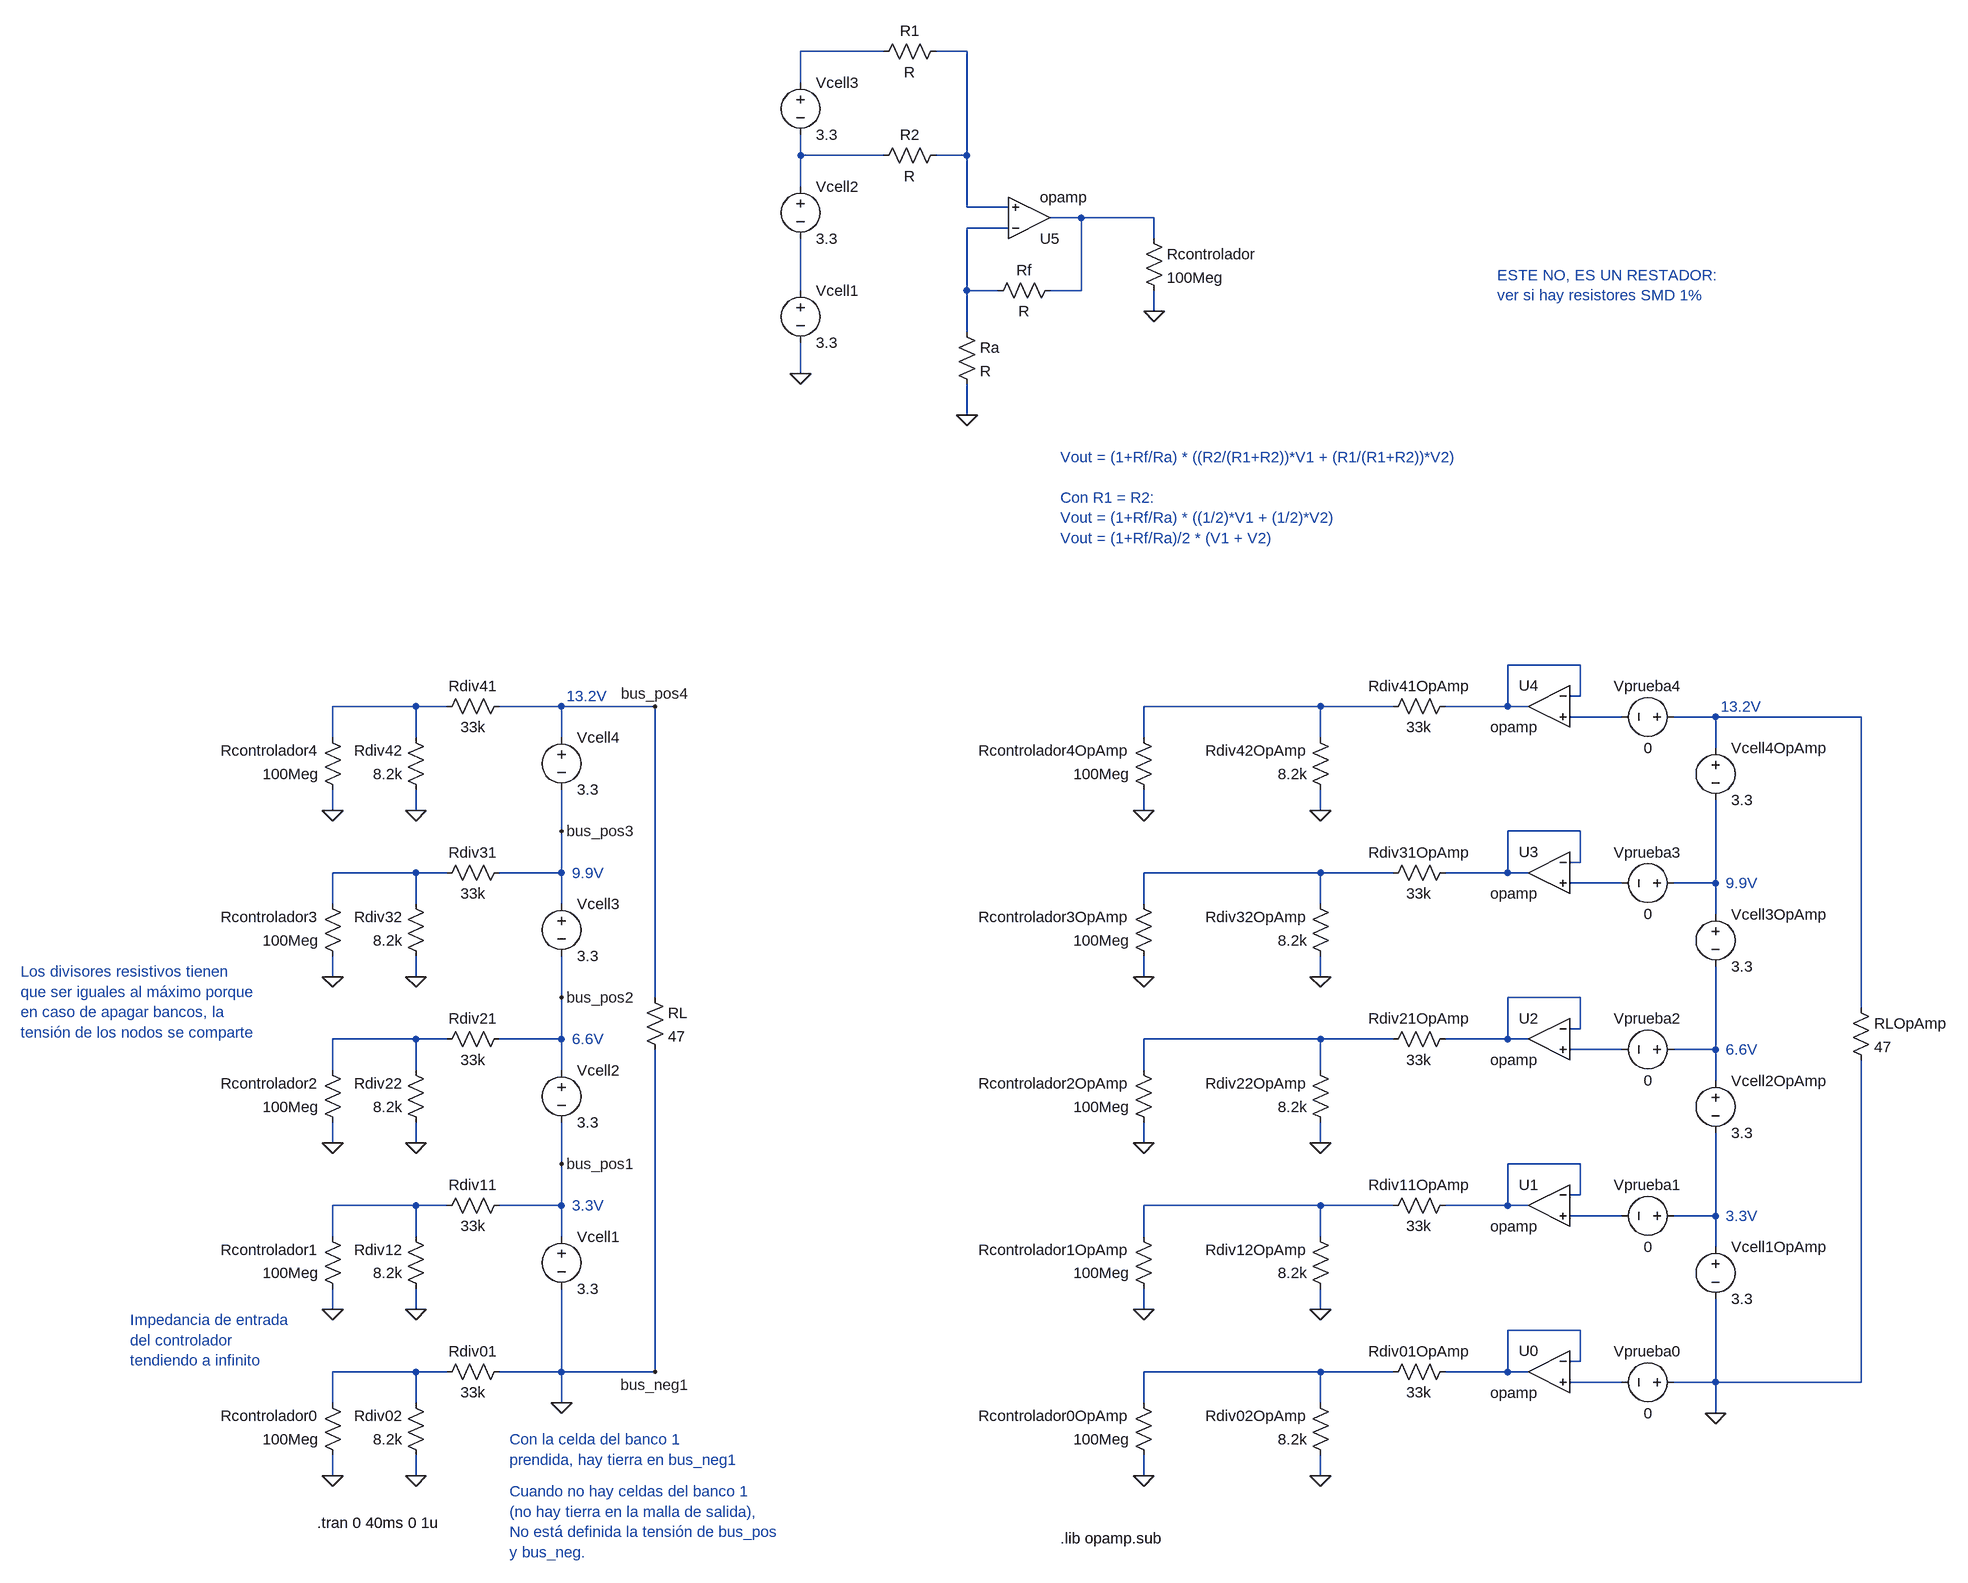
[diagram p0: schematic Opamps en modo sumador no inversor.asc]
Opamps en modo sumador no inversor.asc, the LTspice schematic file:
Version 4.1
SHEET 1 2156 1480
WIRE 512 -1712 384 -1712
WIRE 640 -1712 592 -1712
WIRE 384 -1664 384 -1712
WIRE 384 -1552 384 -1584
WIRE 512 -1552 384 -1552
WIRE 640 -1552 640 -1712
WIRE 640 -1552 592 -1552
WIRE 384 -1504 384 -1552
WIRE 640 -1472 640 -1552
WIRE 704 -1472 640 -1472
WIRE 816 -1456 768 -1456
WIRE 928 -1456 816 -1456
WIRE 704 -1440 640 -1440
WIRE 928 -1424 928 -1456
WIRE 384 -1344 384 -1424
WIRE 640 -1344 640 -1440
WIRE 688 -1344 640 -1344
WIRE 816 -1344 816 -1456
WIRE 816 -1344 768 -1344
WIRE 928 -1312 928 -1344
WIRE 640 -1280 640 -1344
WIRE 384 -1216 384 -1264
WIRE 640 -1152 640 -1200
WIRE 1584 -768 1472 -768
WIRE 1584 -720 1584 -768
WIRE 1584 -720 1568 -720
WIRE -208 -704 -336 -704
WIRE -160 -704 -208 -704
WIRE 16 -704 -80 -704
WIRE 160 -704 16 -704
WIRE 1184 -704 912 -704
WIRE 1296 -704 1184 -704
WIRE 1472 -704 1472 -768
WIRE 1472 -704 1376 -704
WIRE 1504 -704 1472 -704
WIRE 1648 -688 1568 -688
WIRE 1792 -688 1728 -688
WIRE 2016 -688 1792 -688
WIRE -336 -656 -336 -704
WIRE -208 -656 -208 -704
WIRE 16 -656 16 -704
WIRE 912 -656 912 -704
WIRE 1184 -656 1184 -704
WIRE 1792 -640 1792 -688
WIRE -336 -544 -336 -576
WIRE -208 -544 -208 -576
WIRE 912 -544 912 -576
WIRE 1184 -544 1184 -576
WIRE 16 -512 16 -576
WIRE 1584 -512 1472 -512
WIRE 1584 -464 1584 -512
WIRE 1584 -464 1568 -464
WIRE -208 -448 -336 -448
WIRE -160 -448 -208 -448
WIRE 16 -448 16 -512
WIRE 16 -448 -80 -448
WIRE 1184 -448 912 -448
WIRE 1296 -448 1184 -448
WIRE 1472 -448 1472 -512
WIRE 1472 -448 1376 -448
WIRE 1504 -448 1472 -448
WIRE 1648 -432 1568 -432
WIRE 1792 -432 1792 -560
WIRE 1792 -432 1728 -432
WIRE -336 -400 -336 -448
WIRE -208 -400 -208 -448
WIRE 16 -400 16 -448
WIRE 912 -400 912 -448
WIRE 1184 -400 1184 -448
WIRE 1792 -384 1792 -432
WIRE -336 -288 -336 -320
WIRE -208 -288 -208 -320
WIRE 912 -288 912 -320
WIRE 1184 -288 1184 -320
WIRE 16 -256 16 -320
WIRE 160 -256 160 -704
WIRE 1584 -256 1472 -256
WIRE 2016 -240 2016 -688
WIRE 1584 -208 1584 -256
WIRE 1584 -208 1568 -208
WIRE -208 -192 -336 -192
WIRE -160 -192 -208 -192
WIRE 16 -192 16 -256
WIRE 16 -192 -80 -192
WIRE 1184 -192 912 -192
WIRE 1296 -192 1184 -192
WIRE 1472 -192 1472 -256
WIRE 1472 -192 1376 -192
WIRE 1504 -192 1472 -192
WIRE 1648 -176 1568 -176
WIRE 1792 -176 1792 -304
WIRE 1792 -176 1728 -176
WIRE -336 -144 -336 -192
WIRE -208 -144 -208 -192
WIRE 16 -144 16 -192
WIRE 912 -144 912 -192
WIRE 1184 -144 1184 -192
WIRE 1792 -128 1792 -176
WIRE -336 -32 -336 -64
WIRE -208 -32 -208 -64
WIRE 912 -32 912 -64
WIRE 1184 -32 1184 -64
WIRE 16 0 16 -64
WIRE 1584 0 1472 0
WIRE 1584 48 1584 0
WIRE 1584 48 1568 48
WIRE -208 64 -336 64
WIRE -160 64 -208 64
WIRE 16 64 16 0
WIRE 16 64 -80 64
WIRE 1184 64 912 64
WIRE 1296 64 1184 64
WIRE 1472 64 1472 0
WIRE 1472 64 1376 64
WIRE 1504 64 1472 64
WIRE 1648 80 1568 80
WIRE 1792 80 1792 -48
WIRE 1792 80 1728 80
WIRE -336 112 -336 64
WIRE -208 112 -208 64
WIRE 16 112 16 64
WIRE 912 112 912 64
WIRE 1184 112 1184 64
WIRE 1792 128 1792 80
WIRE -336 224 -336 192
WIRE -208 224 -208 192
WIRE 912 224 912 192
WIRE 1184 224 1184 192
WIRE 1584 256 1472 256
WIRE 1584 304 1584 256
WIRE 1584 304 1568 304
WIRE -208 320 -336 320
WIRE -160 320 -208 320
WIRE 16 320 16 192
WIRE 16 320 -80 320
WIRE 160 320 160 -176
WIRE 160 320 16 320
WIRE 1184 320 912 320
WIRE 1296 320 1184 320
WIRE 1472 320 1472 256
WIRE 1472 320 1376 320
WIRE 1504 320 1472 320
WIRE 1648 336 1568 336
WIRE 1792 336 1792 208
WIRE 1792 336 1728 336
WIRE 2016 336 2016 -160
WIRE 2016 336 1792 336
WIRE -336 368 -336 320
WIRE -208 368 -208 320
WIRE 16 368 16 320
WIRE 912 368 912 320
WIRE 1184 368 1184 320
WIRE 1792 384 1792 336
WIRE -336 480 -336 448
WIRE -208 480 -208 448
WIRE 912 480 912 448
WIRE 1184 480 1184 448
FLAG -336 224 0
FLAG 16 0 bus_pos1
FLAG 160 320 bus_neg1
FLAG -208 -32 0
FLAG -336 -32 0
FLAG 16 368 0
FLAG -208 -288 0
FLAG -336 -288 0
FLAG -208 -544 0
FLAG -336 -544 0
FLAG 160 -704 bus_pos4
FLAG 16 -512 bus_pos3
FLAG 16 -256 bus_pos2
FLAG -208 480 0
FLAG -336 480 0
FLAG 912 224 0
FLAG 1184 -32 0
FLAG 912 -32 0
FLAG 1792 384 0
FLAG 1184 -288 0
FLAG 912 -288 0
FLAG 1184 -544 0
FLAG 912 -544 0
FLAG 1184 480 0
FLAG 912 480 0
FLAG -208 224 0
FLAG 1184 224 0
FLAG 640 -1152 0
FLAG 928 -1312 0
FLAG 384 -1216 0
SYMBOL voltage 16 96 R0
SYMATTR InstName Vcell1
SYMATTR Value 3.3
SYMBOL res 144 -272 R0
SYMATTR InstName RL
SYMATTR Value 47
SYMBOL res -320 208 R180
WINDOW 0 36 76 Left 2
WINDOW 3 36 40 Left 2
SYMATTR InstName Rcontrolador1
SYMATTR Value 100Meg
SYMBOL voltage 16 -160 R0
SYMATTR InstName Vcell2
SYMATTR Value 3.3
SYMBOL res -64 -208 R90
WINDOW 0 0 56 VBottom 2
WINDOW 3 32 56 VTop 2
SYMATTR InstName Rdiv21
SYMATTR Value 33k
SYMBOL res -192 -48 R180
WINDOW 0 36 76 Left 2
WINDOW 3 36 40 Left 2
SYMATTR InstName Rdiv22
SYMATTR Value 8.2k
SYMBOL res -320 -48 R180
WINDOW 0 36 76 Left 2
WINDOW 3 36 40 Left 2
SYMATTR InstName Rcontrolador2
SYMATTR Value 100Meg
SYMBOL voltage 16 -416 R0
SYMATTR InstName Vcell3
SYMATTR Value 3.3
SYMBOL res -64 -464 R90
WINDOW 0 0 56 VBottom 2
WINDOW 3 32 56 VTop 2
SYMATTR InstName Rdiv31
SYMATTR Value 33k
SYMBOL res -192 -304 R180
WINDOW 0 36 76 Left 2
WINDOW 3 36 40 Left 2
SYMATTR InstName Rdiv32
SYMATTR Value 8.2k
SYMBOL res -320 -304 R180
WINDOW 0 36 76 Left 2
WINDOW 3 36 40 Left 2
SYMATTR InstName Rcontrolador3
SYMATTR Value 100Meg
SYMBOL voltage 16 -672 R0
SYMATTR InstName Vcell4
SYMATTR Value 3.3
SYMBOL res -64 -720 R90
WINDOW 0 0 56 VBottom 2
WINDOW 3 32 56 VTop 2
SYMATTR InstName Rdiv41
SYMATTR Value 33k
SYMBOL res -192 -560 R180
WINDOW 0 36 76 Left 2
WINDOW 3 36 40 Left 2
SYMATTR InstName Rdiv42
SYMATTR Value 8.2k
SYMBOL res -320 -560 R180
WINDOW 0 36 76 Left 2
WINDOW 3 36 40 Left 2
SYMATTR InstName Rcontrolador4
SYMATTR Value 100Meg
SYMBOL res -64 304 R90
WINDOW 0 0 56 VBottom 2
WINDOW 3 32 56 VTop 2
SYMATTR InstName Rdiv01
SYMATTR Value 33k
SYMBOL res -192 464 R180
WINDOW 0 36 76 Left 2
WINDOW 3 36 40 Left 2
SYMATTR InstName Rdiv02
SYMATTR Value 8.2k
SYMBOL res -320 464 R180
WINDOW 0 36 76 Left 2
WINDOW 3 36 40 Left 2
SYMATTR InstName Rcontrolador0
SYMATTR Value 100Meg
SYMBOL voltage 1792 112 R0
SYMATTR InstName Vcell1OpAmp
SYMATTR Value 3.3
SYMBOL res 2000 -256 R0
SYMATTR InstName RLOpAmp
SYMATTR Value 47
SYMBOL res 928 208 R180
WINDOW 0 36 76 Left 2
WINDOW 3 36 40 Left 2
SYMATTR InstName Rcontrolador1OpAmp
SYMATTR Value 100Meg
SYMBOL voltage 1792 -144 R0
SYMATTR InstName Vcell2OpAmp
SYMATTR Value 3.3
SYMBOL res 1392 -208 R90
WINDOW 0 0 56 VBottom 2
WINDOW 3 32 56 VTop 2
SYMATTR InstName Rdiv21OpAmp
SYMATTR Value 33k
SYMBOL res 1200 -48 R180
WINDOW 0 36 76 Left 2
WINDOW 3 36 40 Left 2
SYMATTR InstName Rdiv22OpAmp
SYMATTR Value 8.2k
SYMBOL res 928 -48 R180
WINDOW 0 36 76 Left 2
WINDOW 3 36 40 Left 2
SYMATTR InstName Rcontrolador2OpAmp
SYMATTR Value 100Meg
SYMBOL voltage 1792 -400 R0
SYMATTR InstName Vcell3OpAmp
SYMATTR Value 3.3
SYMBOL res 1392 -464 R90
WINDOW 0 0 56 VBottom 2
WINDOW 3 32 56 VTop 2
SYMATTR InstName Rdiv31OpAmp
SYMATTR Value 33k
SYMBOL res 1200 -304 R180
WINDOW 0 36 76 Left 2
WINDOW 3 36 40 Left 2
SYMATTR InstName Rdiv32OpAmp
SYMATTR Value 8.2k
SYMBOL res 928 -304 R180
WINDOW 0 36 76 Left 2
WINDOW 3 36 40 Left 2
SYMATTR InstName Rcontrolador3OpAmp
SYMATTR Value 100Meg
SYMBOL voltage 1792 -656 R0
SYMATTR InstName Vcell4OpAmp
SYMATTR Value 3.3
SYMBOL res 1392 -720 R90
WINDOW 0 0 56 VBottom 2
WINDOW 3 32 56 VTop 2
SYMATTR InstName Rdiv41OpAmp
SYMATTR Value 33k
SYMBOL res 1200 -560 R180
WINDOW 0 36 76 Left 2
WINDOW 3 36 40 Left 2
SYMATTR InstName Rdiv42OpAmp
SYMATTR Value 8.2k
SYMBOL res 928 -560 R180
WINDOW 0 36 76 Left 2
WINDOW 3 36 40 Left 2
SYMATTR InstName Rcontrolador4OpAmp
SYMATTR Value 100Meg
SYMBOL res 1392 304 R90
WINDOW 0 0 56 VBottom 2
WINDOW 3 32 56 VTop 2
SYMATTR InstName Rdiv01OpAmp
SYMATTR Value 33k
SYMBOL res 1200 464 R180
WINDOW 0 36 76 Left 2
WINDOW 3 36 40 Left 2
SYMATTR InstName Rdiv02OpAmp
SYMATTR Value 8.2k
SYMBOL res 928 464 R180
WINDOW 0 36 76 Left 2
WINDOW 3 36 40 Left 2
SYMATTR InstName Rcontrolador0OpAmp
SYMATTR Value 100Meg
SYMBOL OpAmps\\opamp 1536 0 M0
SYMATTR InstName U1
SYMBOL OpAmps\\opamp 1536 256 M0
SYMATTR InstName U0
SYMBOL voltage 1744 80 R90
WINDOW 0 -32 56 VBottom 2
WINDOW 3 32 56 VTop 2
SYMATTR InstName Vprueba1
SYMATTR Value 0
SYMBOL voltage 1744 336 R90
WINDOW 0 -32 56 VBottom 2
WINDOW 3 32 56 VTop 2
SYMATTR InstName Vprueba0
SYMATTR Value 0
SYMBOL OpAmps\\opamp 1536 -512 M0
SYMATTR InstName U3
SYMBOL OpAmps\\opamp 1536 -256 M0
SYMATTR InstName U2
SYMBOL voltage 1744 -432 R90
WINDOW 0 -32 56 VBottom 2
WINDOW 3 32 56 VTop 2
SYMATTR InstName Vprueba3
SYMATTR Value 0
SYMBOL voltage 1744 -176 R90
WINDOW 0 -32 56 VBottom 2
WINDOW 3 32 56 VTop 2
SYMATTR InstName Vprueba2
SYMATTR Value 0
SYMBOL OpAmps\\opamp 1536 -768 M0
SYMATTR InstName U4
SYMBOL voltage 1744 -688 R90
WINDOW 0 -32 56 VBottom 2
WINDOW 3 32 56 VTop 2
SYMATTR InstName Vprueba4
SYMATTR Value 0
SYMBOL res -64 48 R90
WINDOW 0 0 56 VBottom 2
WINDOW 3 32 56 VTop 2
SYMATTR InstName Rdiv11
SYMATTR Value 33k
SYMBOL res -192 208 R180
WINDOW 0 36 76 Left 2
WINDOW 3 36 40 Left 2
SYMATTR InstName Rdiv12
SYMATTR Value 8.2k
SYMBOL res 1392 48 R90
WINDOW 0 0 56 VBottom 2
WINDOW 3 32 56 VTop 2
SYMATTR InstName Rdiv11OpAmp
SYMATTR Value 33k
SYMBOL res 1200 208 R180
WINDOW 0 36 76 Left 2
WINDOW 3 36 40 Left 2
SYMATTR InstName Rdiv12OpAmp
SYMATTR Value 8.2k
SYMBOL OpAmps\\opamp 736 -1392 M180
SYMATTR InstName U5
SYMBOL voltage 384 -1680 R0
SYMATTR InstName Vcell3
SYMATTR Value 3.3
SYMBOL res 608 -1728 R90
WINDOW 0 0 56 VBottom 2
WINDOW 3 32 56 VTop 2
SYMATTR InstName R1
SYMBOL res 608 -1568 R90
WINDOW 0 0 56 VBottom 2
WINDOW 3 32 56 VTop 2
SYMATTR InstName R2
SYMBOL res 784 -1360 R90
WINDOW 0 0 56 VBottom 2
WINDOW 3 32 56 VTop 2
SYMATTR InstName Rf
SYMBOL res 624 -1296 R0
SYMATTR InstName Ra
SYMBOL res 912 -1440 R0
SYMATTR InstName Rcontrolador
SYMATTR Value 100Meg
SYMBOL voltage 384 -1520 R0
SYMATTR InstName Vcell2
SYMATTR Value 3.3
SYMBOL voltage 384 -1360 R0
SYMATTR InstName Vcell1
SYMATTR Value 3.3
TEXT -648 240 Left 2 ;Impedancia de entrada\ndel controlador\ntendiendo a infinito
TEXT -360 552 Left 2 !.tran 0 40ms 0 1u
TEXT -64 424 Left 2 ;Con la celda del banco 1\nprendida, hay tierra en bus_neg1
TEXT -64 504 Left 2 ;Cuando no hay celdas del banco 1\n(no hay tierra en la malla de salida),\nNo está definida la tensión de bus_pos\ny bus_neg.
TEXT 784 576 Left 2 !.lib opamp.sub
TEXT 32 64 Left 2 ;3.3V
TEXT 32 -192 Left 2 ;6.6V
TEXT 32 -448 Left 2 ;9.9V
TEXT 24 -720 Left 2 ;13.2V
TEXT 1808 80 Left 2 ;3.3V
TEXT 1808 -176 Left 2 ;6.6V
TEXT 1808 -432 Left 2 ;9.9V
TEXT 1800 -704 Left 2 ;13.2V
TEXT -816 -296 Left 2 ;Los divisores resistivos tienen\nque ser iguales al máximo porque\nen caso de apagar bancos, la\ntensión de los nodos se comparte
TEXT 784 -1088 Left 2 ;Vout = (1+Rf/Ra) * ((R2/(R1+R2))*V1 + (R1/(R1+R2))*V2)\n \nCon R1 = R2:\nVout = (1+Rf/Ra) * ((1/2)*V1 + (1/2)*V2)\nVout = (1+Rf/Ra)/2 * (V1 + V2)
TEXT 1456 -1368 Left 2 ;ESTE NO, ES UN RESTADOR:\nver si hay resistores SMD 1%

The netlist it stands for:
* Opamps en modo sumador no inversor.asc
Vcell1 bus_pos1 0 3.3
RL bus_pos4 0 47
Rcontrolador1 0 N023 100Meg
Vcell2 bus_pos2 bus_pos1 3.3
Rdiv21 bus_pos2 N018 33k
Rdiv22 0 N018 8.2k
Rcontrolador2 0 N018 100Meg
Vcell3 bus_pos3 bus_pos2 3.3
Rdiv31 bus_pos3 N013 33k
Rdiv32 0 N013 8.2k
Rcontrolador3 0 N013 100Meg
Vcell4 bus_pos4 bus_pos3 3.3
Rdiv41 bus_pos4 N008 33k
Rdiv42 0 N008 8.2k
Rcontrolador4 0 N008 100Meg
Rdiv01 0 N028 33k
Rdiv02 0 N028 8.2k
Rcontrolador0 0 N028 100Meg
Vcell1OpAmp N026 0 3.3
RLOpAmp N011 0 47
Rcontrolador1OpAmp 0 N024 100Meg
Vcell2OpAmp N021 N026 3.3
Rdiv21OpAmp N017 N019 33k
Rdiv22OpAmp 0 N019 8.2k
Rcontrolador2OpAmp 0 N019 100Meg
Vcell3OpAmp N016 N021 3.3
Rdiv31OpAmp N012 N014 33k
Rdiv32OpAmp 0 N014 8.2k
Rcontrolador3OpAmp 0 N014 100Meg
Vcell4OpAmp N011 N016 3.3
Rdiv41OpAmp N007 N009 33k
Rdiv42OpAmp 0 N009 8.2k
Rcontrolador4OpAmp 0 N009 100Meg
Rdiv01OpAmp N027 N029 33k
Rdiv02OpAmp 0 N029 8.2k
Rcontrolador0OpAmp 0 N029 100Meg
X§U1 N022 N025 N022 opamp Aol=100K GBW=10Meg  ; pins invin noninvin out
X§U0 N027 N030 N027 opamp Aol=100K GBW=10Meg  ; pins invin noninvin out
Vprueba1 N026 N025 0
Vprueba0 0 N030 0
X§U3 N012 N015 N012 opamp Aol=100K GBW=10Meg  ; pins invin noninvin out
X§U2 N017 N020 N017 opamp Aol=100K GBW=10Meg  ; pins invin noninvin out
Vprueba3 N016 N015 0
Vprueba2 N021 N020 0
X§U4 N007 N010 N007 opamp Aol=100K GBW=10Meg  ; pins invin noninvin out
Vprueba4 N011 N010 0
Rdiv11 bus_pos1 N023 33k
Rdiv12 0 N023 8.2k
Rdiv11OpAmp N022 N024 33k
Rdiv12OpAmp 0 N024 8.2k
X§U5 N005 N002 N004 opamp Aol=100K GBW=10Meg  ; pins invin noninvin out
Vcell3 N001 N003 3.3
R1 N002 N001 R
R2 N002 N003 R
Rf N004 N005 R
Ra N005 0 R
Rcontrolador N004 0 100Meg
Vcell2 N003 N006 3.3
Vcell1 N006 0 3.3
* Impedancia de entrada
* del controlador
* tendiendo a infinito
.tran 0 40ms 0 1u
* Con la celda del banco 1
* prendida, hay tierra en bus_neg1
* Cuando no hay celdas del banco 1
* (no hay tierra en la malla de salida),
* No está definida la tensión de bus_pos
* y bus_neg.
.lib opamp.sub
* 3.3V
* 6.6V
* 9.9V
* 13.2V
* 3.3V
* 6.6V
* 9.9V
* 13.2V
* Los divisores resistivos tienen
* que ser iguales al máximo porque
* en caso de apagar bancos, la
* tensión de los nodos se comparte
* Vout = (1+Rf/Ra) * ((R2/(R1+R2))*V1 + (R1/(R1+R2))*V2)
* Con R1 = R2:
* Vout = (1+Rf/Ra) * ((1/2)*V1 + (1/2)*V2)
* Vout = (1+Rf/Ra)/2 * (V1 + V2)
* ESTE NO, ES UN RESTADOR:
* ver si hay resistores SMD 1%
.backanno
.end